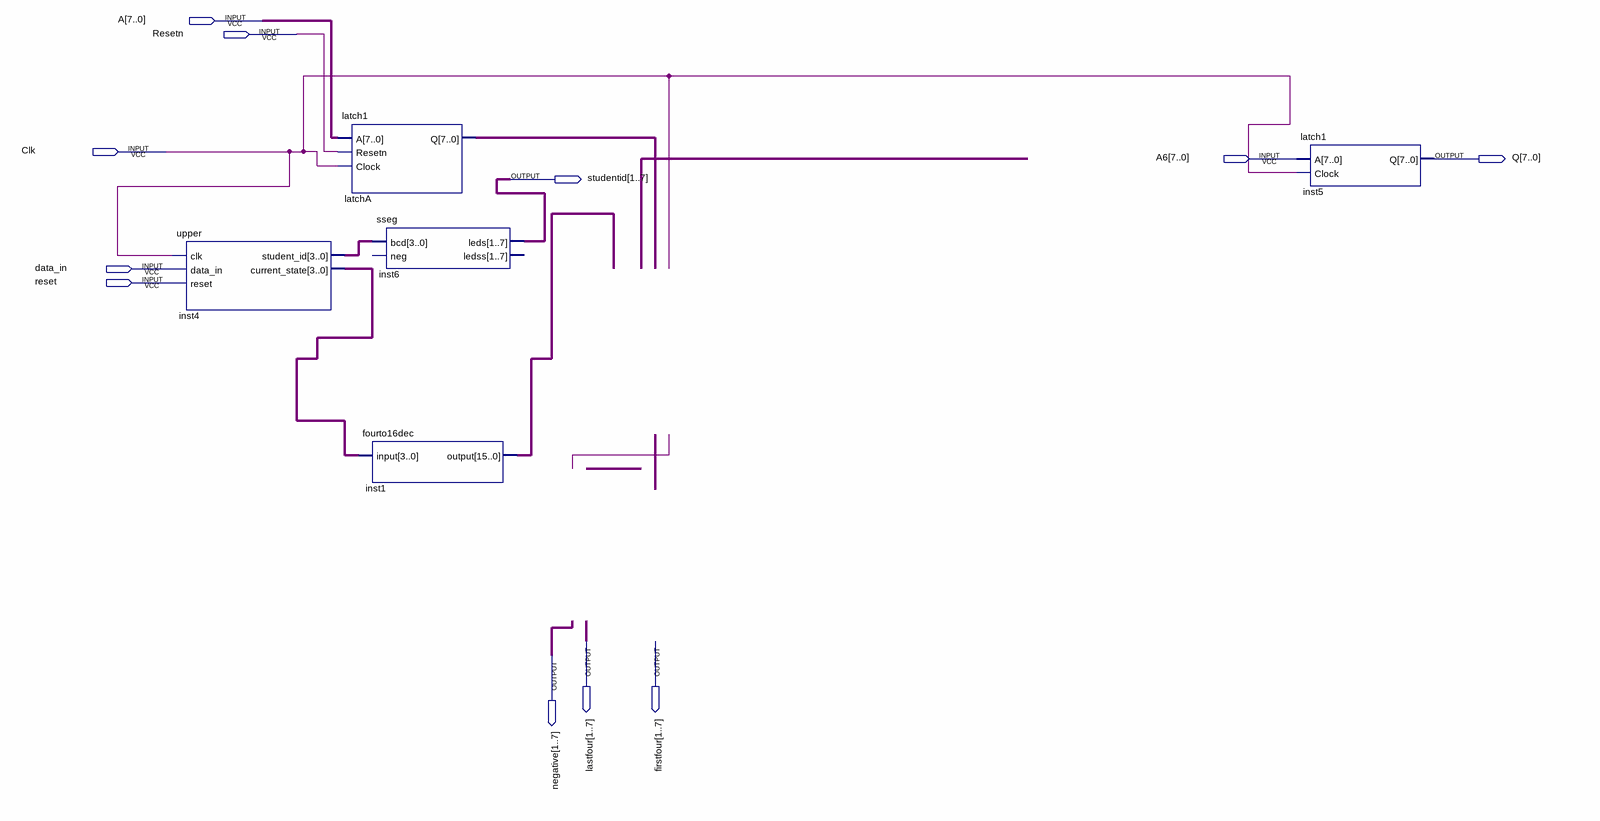
[diagram p0: schematic sheet]
// Quartus schematic ALUfinalfin.bdf as structural Verilog: 5 symbols, 11 pins
module ALUfinalfin (
  input  [7:0] A,
  input  Resetn,
  input  Clk,
  input  [7:0] A6,
  input  data_in,
  input  reset,
  output [7:0] Q,
  output [1:7] studentid,
  output [1:7] lastfour,
  output [1:7] firstfour,
  output [1:7] negative
);

  wire [3:0] inst4_current_state, inst4_student_id;
  wire [7:0] latchA_q;
  wire [15:0] inst1_output;

  upper inst4 (.clk(Clk), .student_id(inst4_student_id), .current_state(inst4_current_state));  // open: data_in, reset
  latch1 latchA (.A(A), .Resetn(Resetn), .Clock(Clk), .Q(latchA_q));
  fourto16dec inst1 (.\input (inst4_current_state), .\output (inst1_output));
  sseg inst6 (.bcd(inst4_student_id), .leds(studentid));  // open: neg, ledss
  latch1 inst5 (.A(A6), .Clock(Clk), .Q(Q));
endmodule
